# EAGLE design Photobooth-RasPI-Controller (EAGLE 7.1.0)

## Sheet 1 of 3
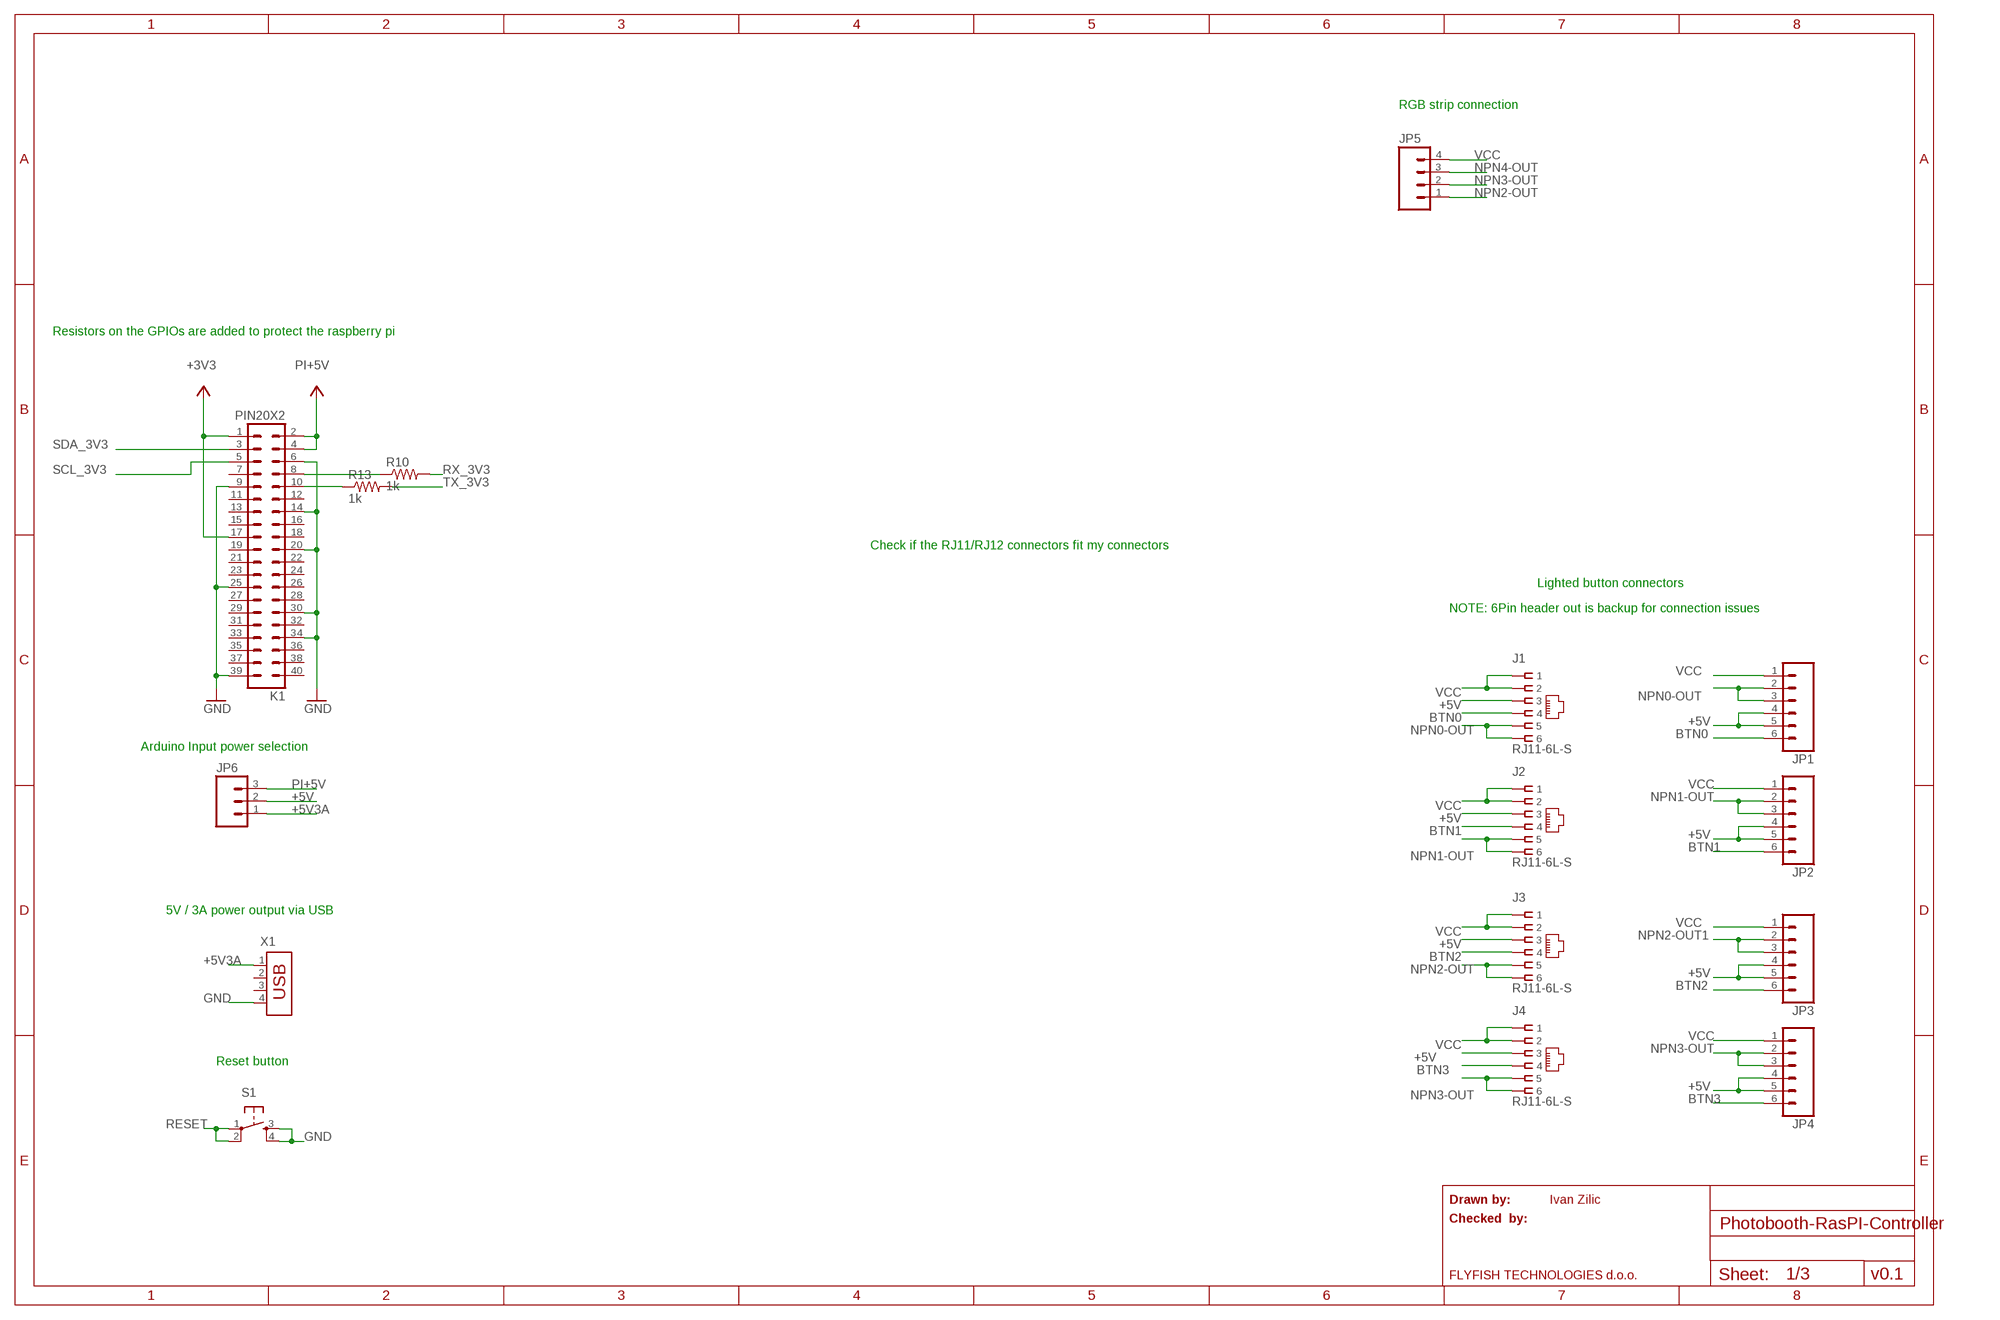
[diagram p0: schematic, sheet 1]

### Parts
J1  RJ11-6L-S  [RJ11-NO_SHIELD]
J2  RJ11-6L-S  [RJ11-NO_SHIELD]
J3  RJ11-6L-S  [RJ11-NO_SHIELD]
J4  RJ11-6L-S  [RJ11-NO_SHIELD]
JP1  M06LOCK  [1X06_LOCK]
JP2  M06LOCK  [1X06_LOCK]
JP3  M06LOCK  [1X06_LOCK]
JP4  M06LOCK  [1X06_LOCK]
JP5  M04LOCK  [1X04_LOCK]
JP6  M03LOCK  [1X03_LOCK]
K1  PIN20X2  [PIN_20X2]
R10  1k  RESISTOR0805-RES  [0805]
R13  1k  RESISTOR0805-RES  [0805]
S1  TAC_SWITCHPTH  [TACTILE-PTH]
X1  USB-787616  [USB]

### Nets
+3V3: K1.1 K1.17 ; also sheet 2
+5V: J1.3 J2.3 J3.3 J4.3 JP1.4 JP1.5 JP2.4 JP2.5 JP3.4 JP3.5 JP4.4 JP4.5 JP6.2 ; also sheet 2
+5V3A: JP6.1 X1.1 ; also sheet 2
BTN0: J1.4 JP1.6 ; also sheet 2
BTN1: J2.4 JP2.6 ; also sheet 2
BTN2: J3.4 JP3.6 ; also sheet 2
BTN3: J4.4 JP4.6 ; also sheet 2
GND: K1.6 K1.9 K1.14 K1.20 K1.25 K1.30 K1.34 K1.39 S1.3 S1.4 X1.4 ; also sheet 2,3
N$3: K1.8 R10.1
N$5: K1.10 R13.1
NPN0-OUT: J1.5 J1.6 JP1.2 JP1.3 ; also sheet 3
NPN1-OUT: J2.5 J2.6 JP2.2 JP2.3 ; also sheet 3
NPN2-OUT: J3.5 J3.6 JP5.1 ; also sheet 3
NPN2-OUT1: JP3.2 JP3.3
NPN3-OUT: J4.5 J4.6 JP4.2 JP4.3 JP5.2 ; also sheet 3
NPN4-OUT: JP5.3 ; also sheet 3
PI+5V: JP6.3 K1.2 K1.4
RESET: S1.1 S1.2 ; also sheet 2
RX_3V3: R10.2 ; also sheet 2
SCL_3V3: K1.5 ; also sheet 2
SDA_3V3: K1.3 ; also sheet 2
TX_3V3: R13.2 ; also sheet 2
VCC: J1.1 J1.2 J2.1 J2.2 J3.1 J3.2 J4.1 J4.2 JP1.1 JP2.1 JP3.1 JP4.1 JP5.4 ; also sheet 2
Unconnected: K1.7 K1.11 K1.12 K1.13 K1.15 K1.16 K1.18 K1.19 K1.21 K1.22 K1.23 K1.24 K1.26 K1.27 K1.28 K1.29 K1.31 K1.32 K1.33 K1.35 K1.36 K1.37 K1.38 K1.40 X1.2 X1.3

### Notes on the sheet
- RGB strip connection
- Resistors on the GPIOs are added to protect the raspberry pi
- Check if the RJ11/RJ12 connectors fit my connectors
- Lighted button connectors
- NOTE: 6Pin header out is backup for connection issues
- Arduino Input power selection
- 5V / 3A power output via USB
- Reset button
- Drawn by: | Ivan Zilic
- Checked  by:
- FLYFISH TECHNOLOGIES d.o.o. | v0.1

## Sheet 2 of 3
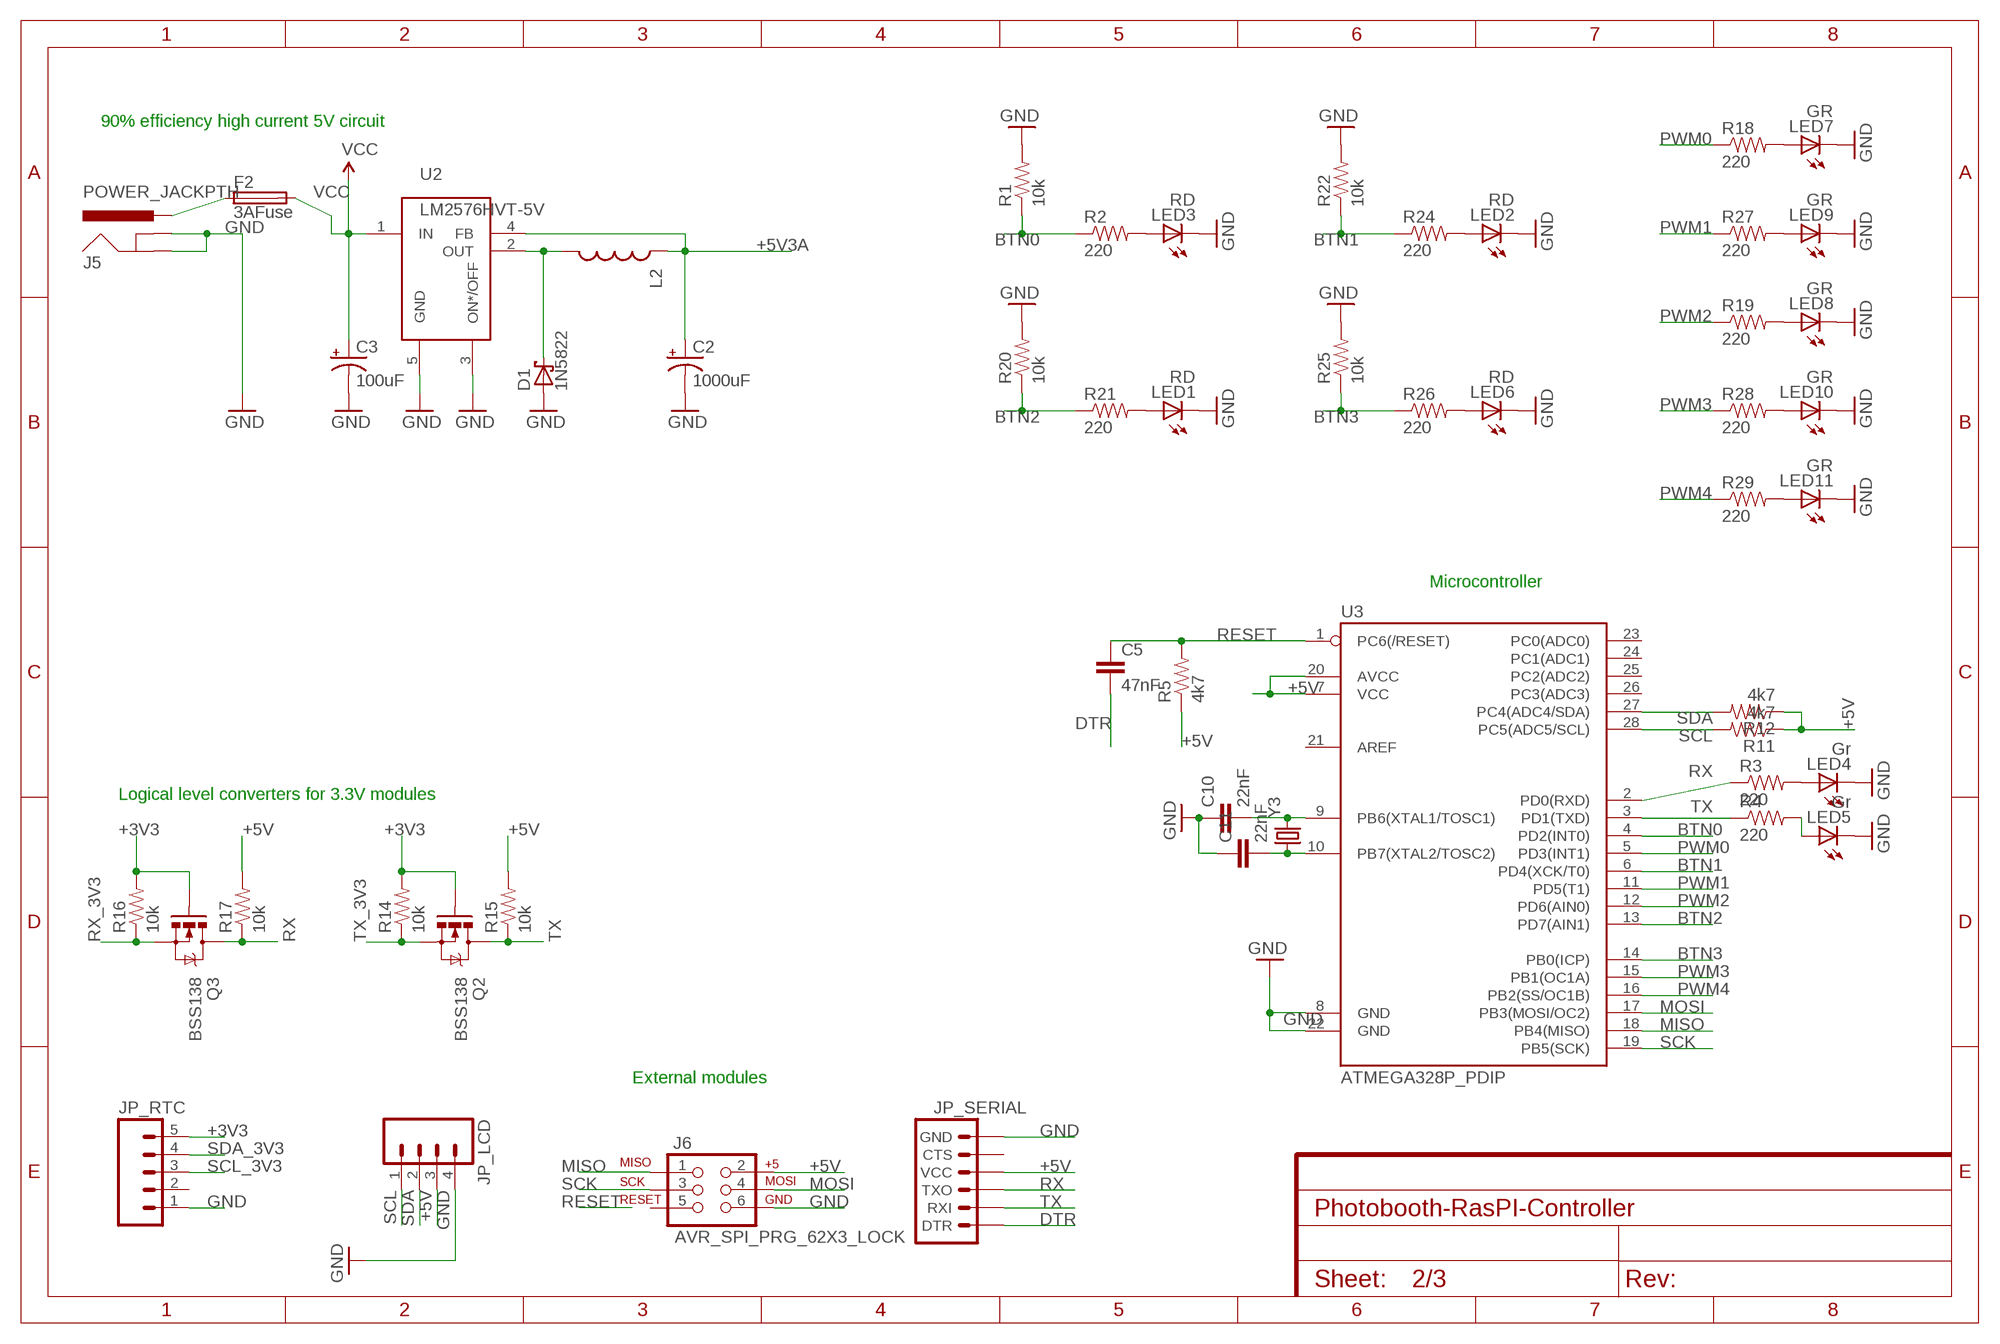
[diagram p1: schematic, sheet 2]

### Parts
C2  1000uF  1000UF-25V(PTH)  [CPOL-RADIAL-1000UF-25V]
C3  100uF  CAP_POLPTH1  [CPOL-RADIAL-100UF-25V]
C5  47nF  CAPPTH  [CAP-PTH-SMALL]
C10  22nF  CAPPTH  [CAP-PTH-SMALL]
C11  22nF  CAPPTH  [CAP-PTH-SMALL]
D1  1N5822  1N5908  [C4111-15]
F2  3AFuse  LITTLEFUSE  [LITTLEFUSE]
J5  POWER_JACKPTH  [POWER_JACK_PTH]
J6  AVR_SPI_PRG_62X3_LOCK  [2X3_LOCK]
JP_LCD  M04PTH  [1X04]
JP_RTC  M05LOCK  [1X05_LOCK]
JP_SERIAL  ARDUINO_SERIAL_PROGRAMLOCK  [1X06_LOCK]
L2  INDUCTORRLB0912  [RLB0912]
LED1  RD  LEDCHIP-LED0805  [CHIP-LED0805]
LED2  RD  LEDCHIP-LED0805  [CHIP-LED0805]
LED3  RD  LEDCHIP-LED0805  [CHIP-LED0805]
LED4  Gr  LEDCHIP-LED0805  [CHIP-LED0805]
LED5  Gr  LEDCHIP-LED0805  [CHIP-LED0805]
LED6  RD  LEDCHIP-LED0805  [CHIP-LED0805]
LED7  GR  LEDCHIP-LED0805  [CHIP-LED0805]
LED8  GR  LEDCHIP-LED0805  [CHIP-LED0805]
LED9  GR  LEDCHIP-LED0805  [CHIP-LED0805]
LED10  GR  LEDCHIP-LED0805  [CHIP-LED0805]
LED11  GR  LEDCHIP-LED0805  [CHIP-LED0805]
Q2  BSS138  MOSFET-NCHANNELBSS138  [SOT23-3]
Q3  BSS138  MOSFET-NCHANNELBSS138  [SOT23-3]
R1  10k  RESISTOR0805-RES  [0805]
R2  220  RESISTOR0805-RES  [0805]
R3  220  RESISTOR0805-RES  [0805]
R4  220  RESISTOR0805-RES  [0805]
R5  4k7  RESISTOR0805-RES  [0805]
R11  4k7  RESISTOR0805-RES  [0805]
R12  4k7  RESISTOR0805-RES  [0805]
R14  10k  RESISTOR0805-RES  [0805]
R15  10k  RESISTOR0805-RES  [0805]
R16  10k  RESISTOR0805-RES  [0805]
R17  10k  RESISTOR0805-RES  [0805]
R18  220  RESISTOR0805-RES  [0805]
R19  220  RESISTOR0805-RES  [0805]
R20  10k  RESISTOR0805-RES  [0805]
R21  220  RESISTOR0805-RES  [0805]
R22  10k  RESISTOR0805-RES  [0805]
R24  220  RESISTOR0805-RES  [0805]
R25  10k  RESISTOR0805-RES  [0805]
R26  220  RESISTOR0805-RES  [0805]
R27  220  RESISTOR0805-RES  [0805]
R28  220  RESISTOR0805-RES  [0805]
R29  220  RESISTOR0805-RES  [0805]
U2  LM2576HVT-5V  LM2576  [LM2576]
U3  ATMEGA328P_PDIP  [DIL28-3]
Y3  CRYSTALHC49UV  [HC49U-V]

### Nets
+3V3: JP_RTC.5 Q2.1(G) Q3.1(G) R14.2 R16.2 ; also sheet 1
+5V: J6.2 JP_LCD.3 JP_SERIAL.4(VCC) R5.1 R11.1 R12.1 R15.2 R17.2 U3.7(VCC) U3.20(AVCC) ; also sheet 1
+5V3A: C2.+ L2.1 U2.4(FB) ; also sheet 1
BTN0: R1.1 R2.1 U3.4(PD2(INT0)) ; also sheet 1
BTN1: R22.1 R24.1 U3.6(PD4(XCK/T0)) ; also sheet 1
BTN2: R20.1 R21.1 U3.13(PD7(AIN1)) ; also sheet 1
BTN3: R25.1 R26.1 U3.14(PB0(ICP)) ; also sheet 1
DTR: C5.2 JP_SERIAL.1(DTR)
GND: C2.- C3.2(-) C10.1 C11.1 D1.A J5.GND J5.GNDBREAK J6.6 JP_LCD.4 JP_RTC.1 JP_SERIAL.6(GND) LED1.C LED2.C LED3.C LED4.C LED5.C LED6.C LED7.C LED8.C LED9.C LED10.C LED11.C R1.2 R20.2 R22.2 R25.2 U2.3(ON*/OFF) U2.5(GND) U3.8(GND) U3.22(GND) ; also sheet 1,3
MISO: J6.1 U3.18(PB4(MISO))
MOSI: J6.4 U3.17(PB3(MOSI/OC2))
N$1: C11.2 U3.10(PB7(XTAL2/TOSC2)) Y3.1
N$2: C10.2 U3.9(PB6(XTAL1/TOSC1)) Y3.2
N$4: D1.C L2.2 U2.2(OUT)
N$6: LED7.A R18.2
N$7: LED8.A R19.2
N$8: LED1.A R21.2
N$9: LED2.A R24.2
N$10: LED6.A R26.2
N$11: LED9.A R27.2
N$12: LED10.A R28.2
N$13: LED11.A R29.2
N$15: F2.1 J5.PWR
N$23: LED3.A R2.2
N$24: LED4.A R3.2
N$25: LED5.A R4.2
PWM0: R18.1 U3.5(PD3(INT1)) ; also sheet 3
PWM1: R27.1 U3.11(PD5(T1)) ; also sheet 3
PWM2: R19.1 U3.12(PD6(AIN0)) ; also sheet 3
PWM3: R28.1 U3.15(PB1(OC1A)) ; also sheet 3
PWM4: R29.1 U3.16(PB2(SS/OC1B)) ; also sheet 3
RESET: C5.1 R5.2 U3.1(PC6(/RESET)) ; also sheet 1
RX: JP_SERIAL.3(TXO) Q3.3(D) R3.1 R17.1 U3.2(PD0(RXD))
RX_3V3: Q3.2(S) R16.1 ; also sheet 1
SCK: J6.3 U3.19(PB5(SCK))
SCL: JP_LCD.1 R11.2 U3.28(PC5(ADC5/SCL))
SCL_3V3: JP_RTC.3 ; also sheet 1
SDA: JP_LCD.2 R12.2 U3.27(PC4(ADC4/SDA))
SDA_3V3: JP_RTC.4 ; also sheet 1
TX: JP_SERIAL.2(RXI) Q2.3(D) R4.1 R15.1 U3.3(PD1(TXD))
TX_3V3: Q2.2(S) R14.1 ; also sheet 1
VCC: C3.1(+) F2.2 U2.1(IN) ; also sheet 1
Unconnected: J6.5 JP_RTC.2 JP_SERIAL.5(CTS) U3.21(AREF) U3.23(PC0(ADC0)) U3.24(PC1(ADC1)) U3.25(PC2(ADC2)) U3.26(PC3(ADC3))

### Notes on the sheet
- 90% efficiency high current 5V circuit
- Microcontroller
- Logical level converters for 3.3V modules
- External modules

## Sheet 3 of 3
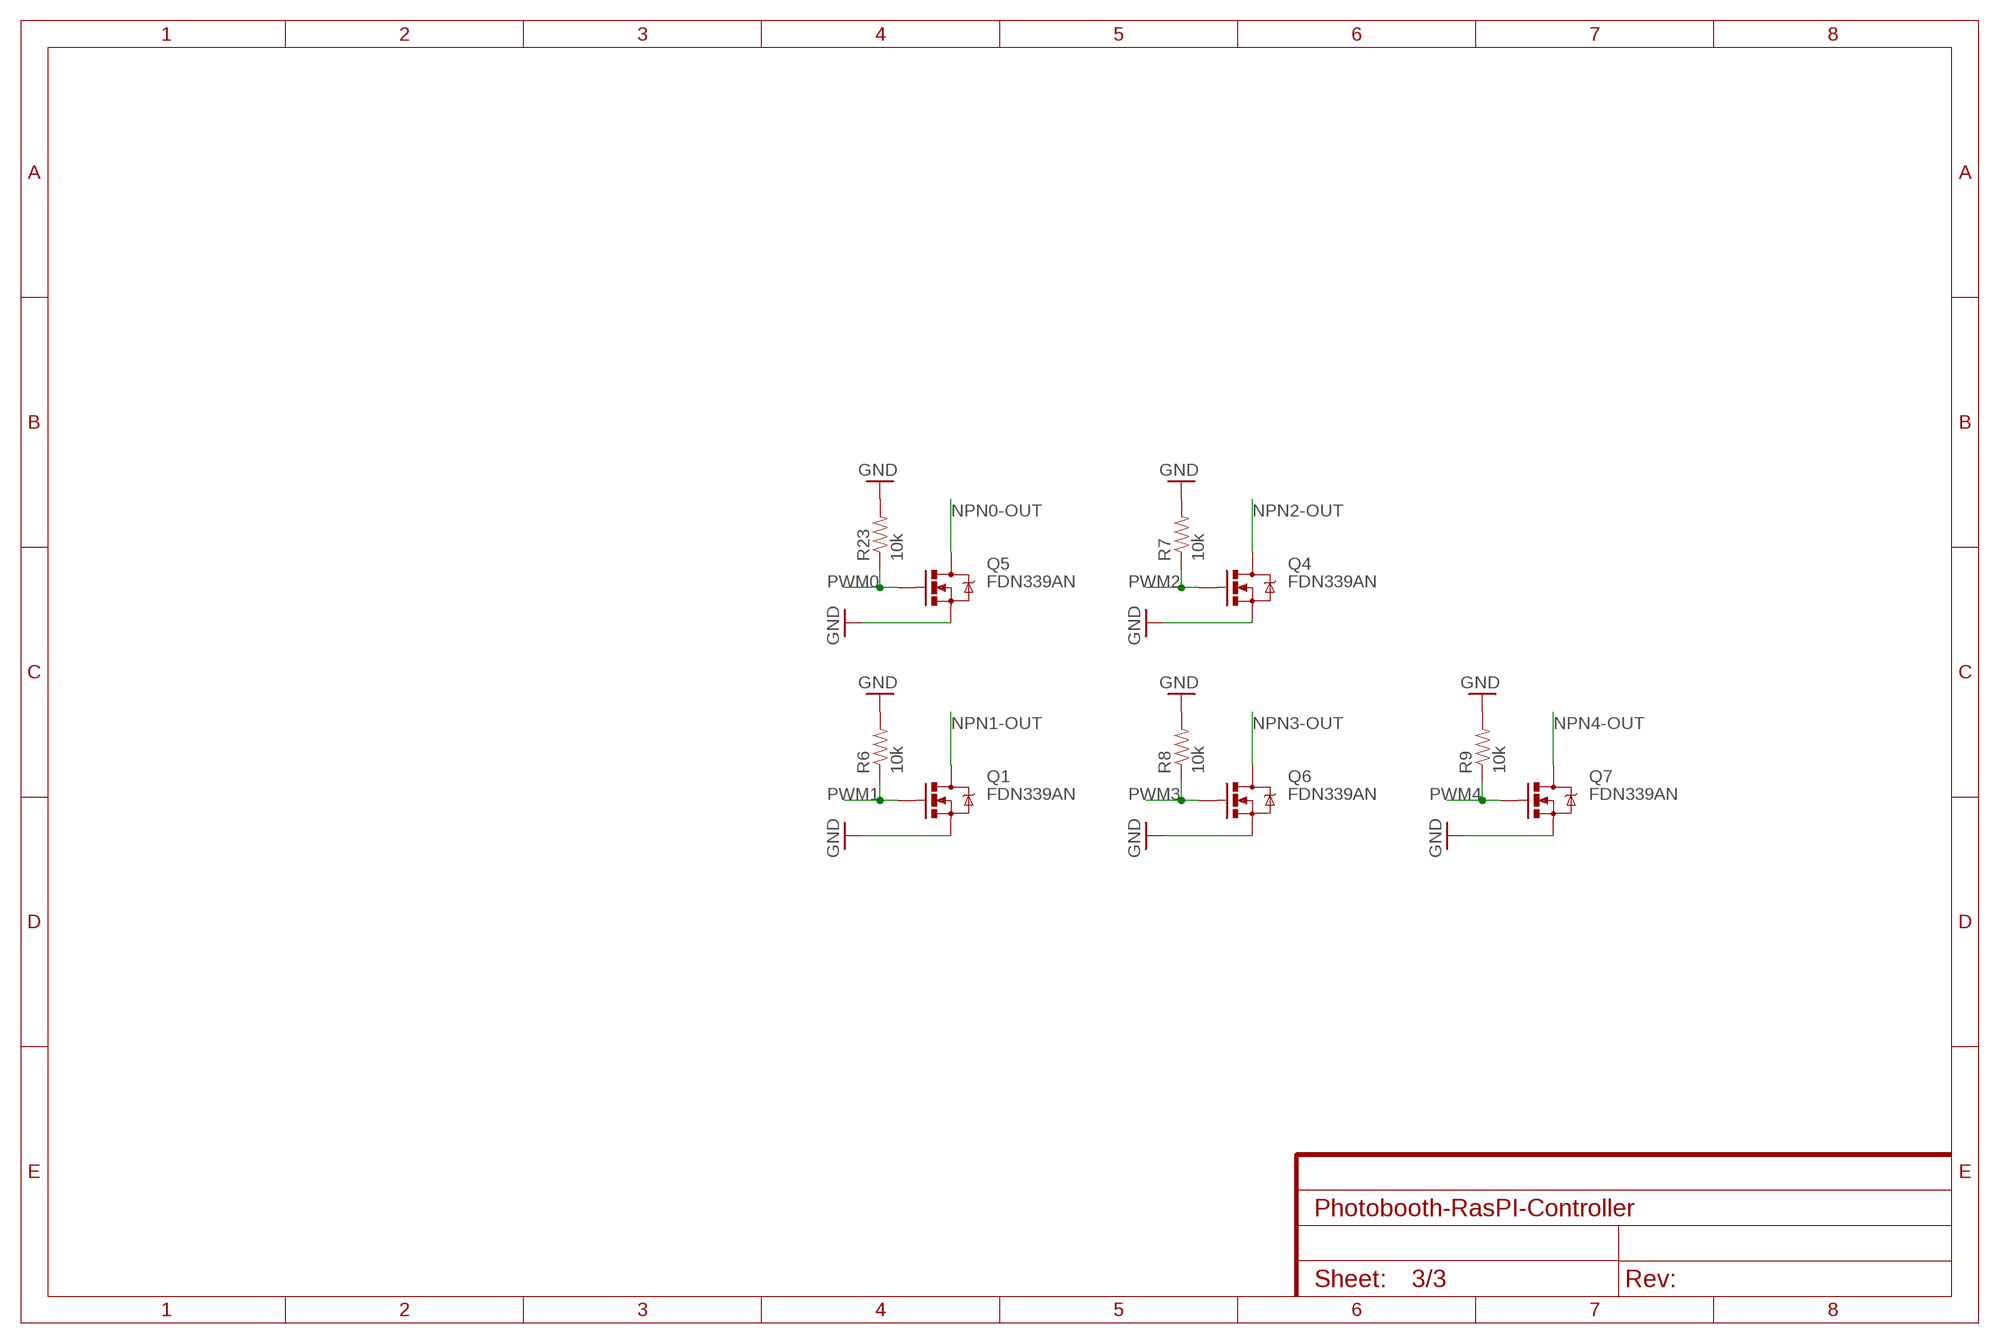
[diagram p2: schematic, sheet 3]

### Parts
Q1  FDN339AN  MOSFET-NCHANNELBSS138  [SOT23-3]
Q4  FDN339AN  MOSFET-NCHANNELBSS138  [SOT23-3]
Q5  FDN339AN  MOSFET-NCHANNELBSS138  [SOT23-3]
Q6  FDN339AN  MOSFET-NCHANNELBSS138  [SOT23-3]
Q7  FDN339AN  MOSFET-NCHANNELBSS138  [SOT23-3]
R6  10k  RESISTOR0805-RES  [0805]
R7  10k  RESISTOR0805-RES  [0805]
R8  10k  RESISTOR0805-RES  [0805]
R9  10k  RESISTOR0805-RES  [0805]
R23  10k  RESISTOR0805-RES  [0805]

### Nets
GND: Q1.2(S) Q4.2(S) Q5.2(S) Q6.2(S) Q7.2(S) R6.2 R7.2 R8.2 R9.2 R23.2 ; also sheet 1,2
NPN0-OUT: Q5.3(D) ; also sheet 1
NPN1-OUT: Q1.3(D) ; also sheet 1
NPN2-OUT: Q4.3(D) ; also sheet 1
NPN3-OUT: Q6.3(D) ; also sheet 1
NPN4-OUT: Q7.3(D) ; also sheet 1
PWM0: Q5.1(G) R23.1 ; also sheet 2
PWM1: Q1.1(G) R6.1 ; also sheet 2
PWM2: Q4.1(G) R7.1 ; also sheet 2
PWM3: Q6.1(G) R8.1 ; also sheet 2
PWM4: Q7.1(G) R9.1 ; also sheet 2

## Library data of the parts
C2 = SparkFun-Capacitors:1000UF-25V(PTH): CAP-08070; PROD_ID: CAP-09538; VALUE: CAP-09538
C3 = SparkFun-Capacitors:CAP_POL: Capacitor Polarized These are standard SMD and PTH capacitors. Normally 10uF, 47uF, and 100uF in electrolytic and tantalum varieties. Always verify the external diameter of the through hole cap, it varies with capacity, voltage, and manufacturer. The EIA devices should be standard.
C5 C10 C11 = SparkFun-Capacitors:CAP: Capacitor Standard 0603 ceramic capacitor, and 0.1" leaded capacitor.
D1 = diode:1N5908: DIODE schottky
F2 = fuse:LITTLEFUSE: LITTLEFUSE Picofuse/slow Littlefuse; OC_FARNELL: unknown; OC_NEWARK: unknown
J1-J4 = con-tycoelectronics:RJ11: CORCOM Modular RJ Jacks No Shield Source: www.tycoelectronics.com .. ENG_DS_1654001_1099_RJ_L_0507.pdf; MF: TYCO ELECTRONICS; MPN: RJ11-6L-S; OC_FARNELL: 1654827; OC_NEWARK: 50F1358
J5 = SparkFun-Connectors:POWER_JACK: Power Jack This is the standard 5.5mm barrel jack for power. The PTH is the most common, proven, reliable, footprint. The Slot footprint only works if the mill layer is transmitted to the PCB fab house so be warned. Mating wall wart : TOL-00298 (and others); PROD_ID: PRT-00119
J6 = SparkFun-Connectors:AVR_SPI_PRG_6: AVR ISP 6 Pin This is the reduced ISP connector for AVR programming. Common on Arduino. This footprint will take up less PCB space and can be used with a 10-pin to 6-pin adapter such as SKU: BOB-08508 **Special note about "TEST_POINT" package. The stop mask is on the top side, so if you want your programming test points to be on the bottom of your board, make sure to place this package on the bottom side of the board. This also ensure that the orientation to program from the bottom side will be correct.
JP1-JP4 = SparkFun-Connectors:M06: Header 6 Standard 6-pin 0.1" header. Use with straight break away headers (SKU : PRT-00116), right angle break away headers (PRT-00553), swiss pins (PRT-00743), machine pins (PRT-00117), and female headers (PRT-00115). Molex polarized connector foot print use with SKU : PRT-08094 with associated crimp pins and housings. NOTES ON THE VARIANTS LOCK and LOCK_LONGPADS... This footprint was designed to help hold the alignment of a through-hole component (i.e. 6-pin header) while soldering it into place. You may notice that each hole has been shifted either up or down by 0.005 of an inch from it's more standard position (which is a perfectly straight line). This slight alteration caused the pins (the squares in the middle) to touch the edges of the holes. Because they are alternating, it causes a "brace" to hold the component in place. 0.005 has proven to be the perfect amount of "off-center" position when using our standard breakaway headers. Although looks a little odd when you look at the bare footprint, once you have a header in there, the alteration is very hard to notice. Also,if you push a header all the way into place, it is covered up entirely on the bottom side. This idea of altering the position of holes to aid alignment will be further integrated into the Sparkfun Library for other footprints. It can help hold any component with 3 or more connection pins.
JP5 JP_LCD = SparkFun-Connectors:M04: Header 4 Standard 4-pin 0.1" header. Use with straight break away headers (SKU : PRT-00116), right angle break away headers (PRT-00553), swiss pins (PRT-00743), machine pins (PRT-00117), and female headers (PRT-00115). Molex polarized connector foot print use with SKU : PRT-08231 with associated crimp pins and housings. 1MM SMD Version SKU: PRT-10208
JP6 = SparkFun-Connectors:M03: Header 3 Standard 3-pin 0.1" header. Use with straight break away headers (SKU : PRT-00116), right angle break away headers (PRT-00553), swiss pins (PRT-00743), machine pins (PRT-00117), and female headers (PRT-00115). Molex polarized connector foot print use with SKU : PRT-08232 with associated crimp pins and housings.
JP_RTC = SparkFun-Connectors:M05: Header 5 Standard 5-pin 0.1" header. Use with straight break away headers (SKU : PRT-00116), right angle break away headers (PRT-00553), swiss pins (PRT-00743), machine pins (PRT-00117), and female headers (PRT-00115). Molex polarized connector foot print use with SKU : PRT-08230 with associated crimp pins and housings.
JP_SERIAL = SparkFun-Connectors:ARDUINO_SERIAL_PROGRAM: FTDI connector footprints
K1 = FLYFISH:PIN20X2
L2 = SparkFun-Passives:INDUCTOR: Inductors Basic Inductor/Choke - 0603 and 1206. Footprints are not proven and vary greatly between part numbers. SRN6045- 33uH, 20% 1.4A SDR0403-560KL - 56uH, 10%, 500mA RMS/740mA peak
LED1-LED11 = led:LED: LED OSRAM: - CHIPLED LG R971, LG N971, LY N971, LG Q971, LY Q971, LO R971, LY R971 LH N974, LH R974 LS Q976, LO Q976, LY Q976 LO Q996 - Hyper CHIPLED LW Q18S LB Q993, LB Q99A, LB R99A - SideLED LS A670, LO A670, LY A670, LG A670, LP A670 LB A673, LV A673, LT A673, LW A673 LH A674 LY A675 LS A676, LA A676, LO A676, LY A676, LW A676 LS A679, LY A679, LG A679 - Hyper Micro SIDELED® LS Y876, LA Y876, LO Y876, LY Y876 LT Y87S - SmartLED LW L88C, LW L88S LB L89C, LB L89S, LG L890 LS L89K, LO L89K, LY L89K LS L896, LA L896, LO L896, LY L896 - TOPLED LS T670, LO T670, LY T670, LG T670, LP T670 LSG T670, LSP T670, LSY T670, LOP T670, LYG T670 LG T671, LOG T671, LSG T671 LB T673, LV T673, LT T673, LW T673 LH T674 LS T676, LA T676, LO T676, LY T676, LB T676, LH T676, LSB T676, LW T676 LB T67C, LV T67C, LT T67C, LS T67K, LO T67K, LY T67K, LW E67C LS E67B, LA E67B, LO E67B, LY E67B, LB E67C, LV E67C, LT E67C LW T67C LS T679, LY T679, LG T679 LS T770, LO T770, LY T770, LG T770, LP T770 LB T773, LV T773, LT T773, LW T773 LH T774 LS E675, LA E675, LY E675, LS T675 LS T776, LA T776, LO T776, LY T776, LB T776 LHGB T686 LT T68C, LB T68C - Hyper Mini TOPLED® LB M676 - Mini TOPLED Santana® LG M470 LS M47K, LO M47K, LY M47K Source: http://www.osram.convergy.de LUXEON: - LUMILED® LXK2-PW12-R00, LXK2-PW12-S00, LXK2-PW14-U00, LXK2-PW14-V00 LXK2-PM12-R00, LXK2-PM12-S00, LXK2-PM14-U00 LXK2-PE12-Q00, LXK2-PE12-R00, LXK2-PE12-S00, LXK2-PE14-T00, LXK2-PE14-U00 LXK2-PB12-K00, LXK2-PB12-L00, LXK2-PB12-M00, LXK2-PB14-N00, LXK2-PB14-P00, LXK2-PB14-Q00 LXK2-PR12-L00, LXK2-PR12-M00, LXK2-PR14-Q00, LXK2-PR14-R00 LXK2-PD12-Q00, LXK2-PD12-R00, LXK2-PD12-S00 LXK2-PH12-R00, LXK2-PH12-S00 LXK2-PL12-P00, LXK2-PL12-Q00, LXK2-PL12-R00 Source: www.luxeon.com KINGBRIGHT: KA-3528ASYC Source: www.kingbright.com
Q1-Q7 = SparkFun-DiscreteSemi:MOSFET-NCHANNEL: Common NMOSFET Parts MFG P/N Store ID Prod ID FDD8780 TRANS-09984 SI7820DN TRANS-11055 FDS6630A IC-08089 2N7002PW TRANS-11151 FQP30N06L COM-10213 TRANS-10060 BSS123LT1G TRANS-08345 BSS138 TRANS-00830 BS170 2N7000; PROD_ID: TRANS-00830
R1-R29 = SparkFun-Passives:RESISTOR: Resistor Basic schematic elements and footprints for 0603, 1206, and PTH resistors.
S1 = SparkFun-Electromechanical:TAC_SWITCH: Momentary Switch Button commonly used for reset or general input. Spark Fun Electronics SKU : COM-00097 SMT- SWCH-08247
U2 = LM2576:LM2576: LM2576 - 5V switching regulator
U3 = SparkFun-DigitalIC:ATMEGA328P_PDIP: uC used in the Arduino 32kb flash, 1k EEPROM, 2k SRAM This is the through-hole version of this chip.
X1 = con-amp:USB-787616: AMP connector
Y3 = SparkFun-FreqCtrl:CRYSTAL: Various standard crystals. Proven footprints. Spark Fun Electronics SKU : COM-00534

## Board
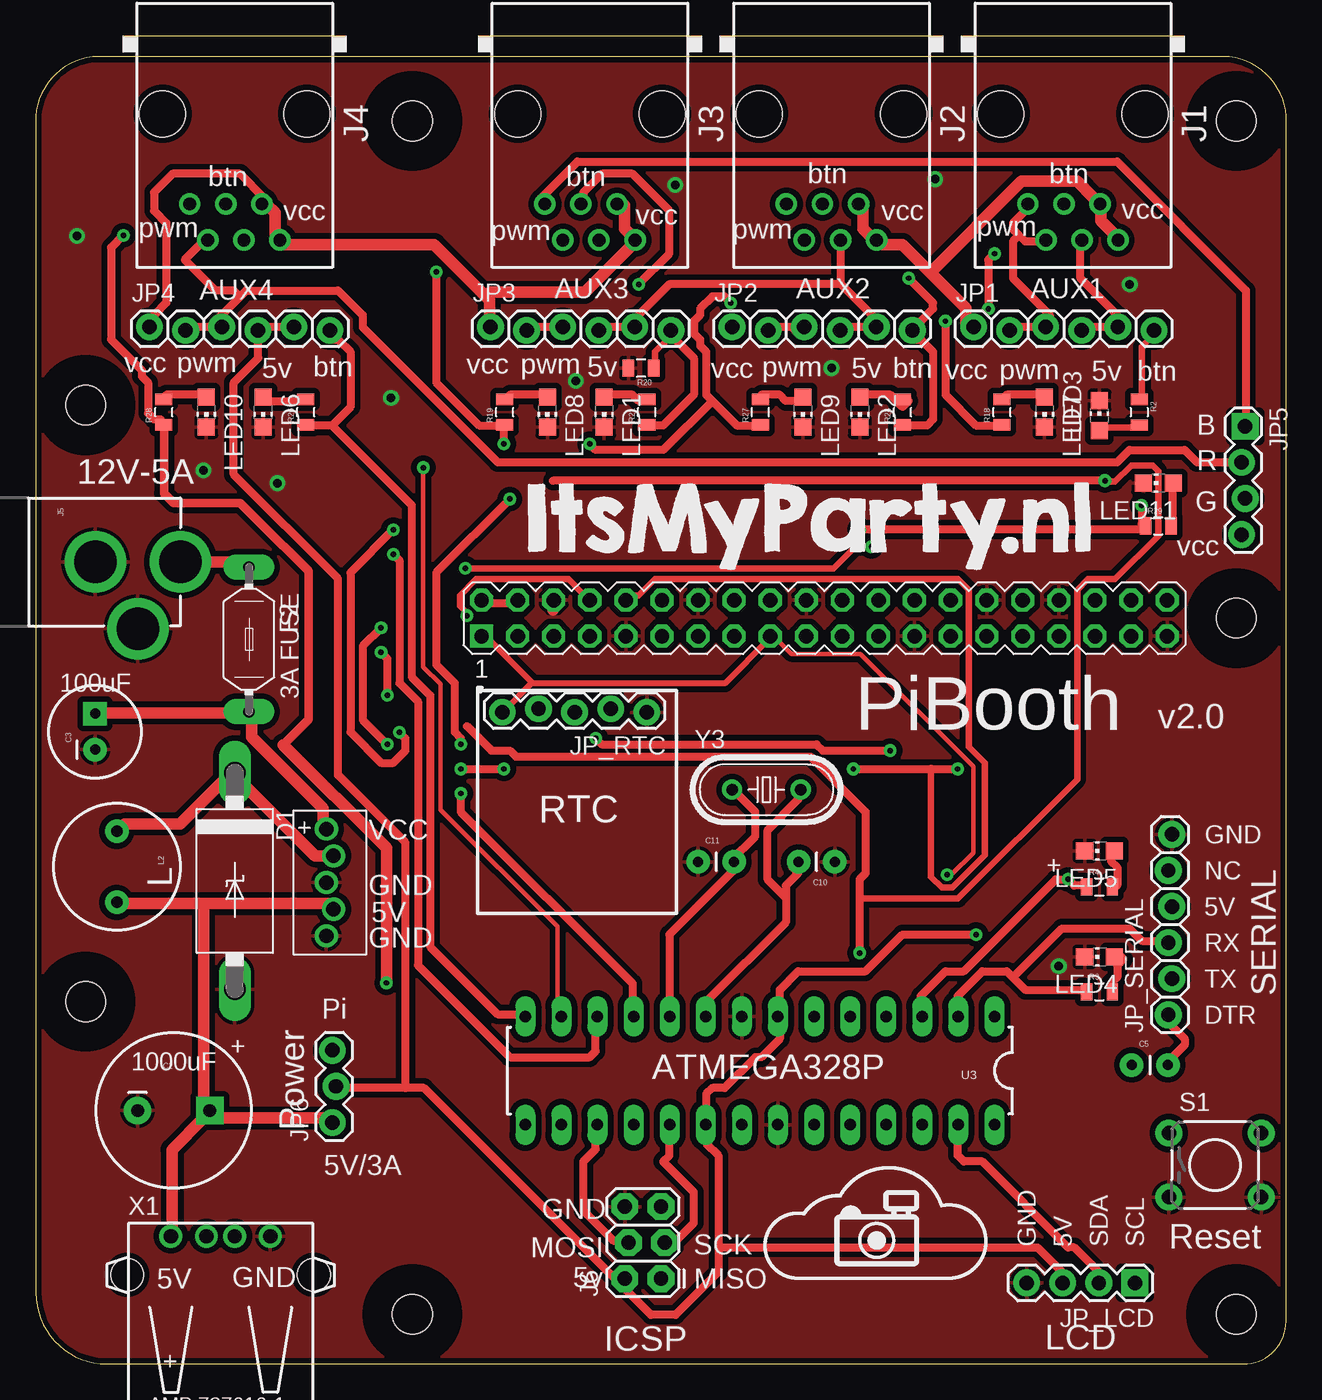
[diagram p3: board, top side]
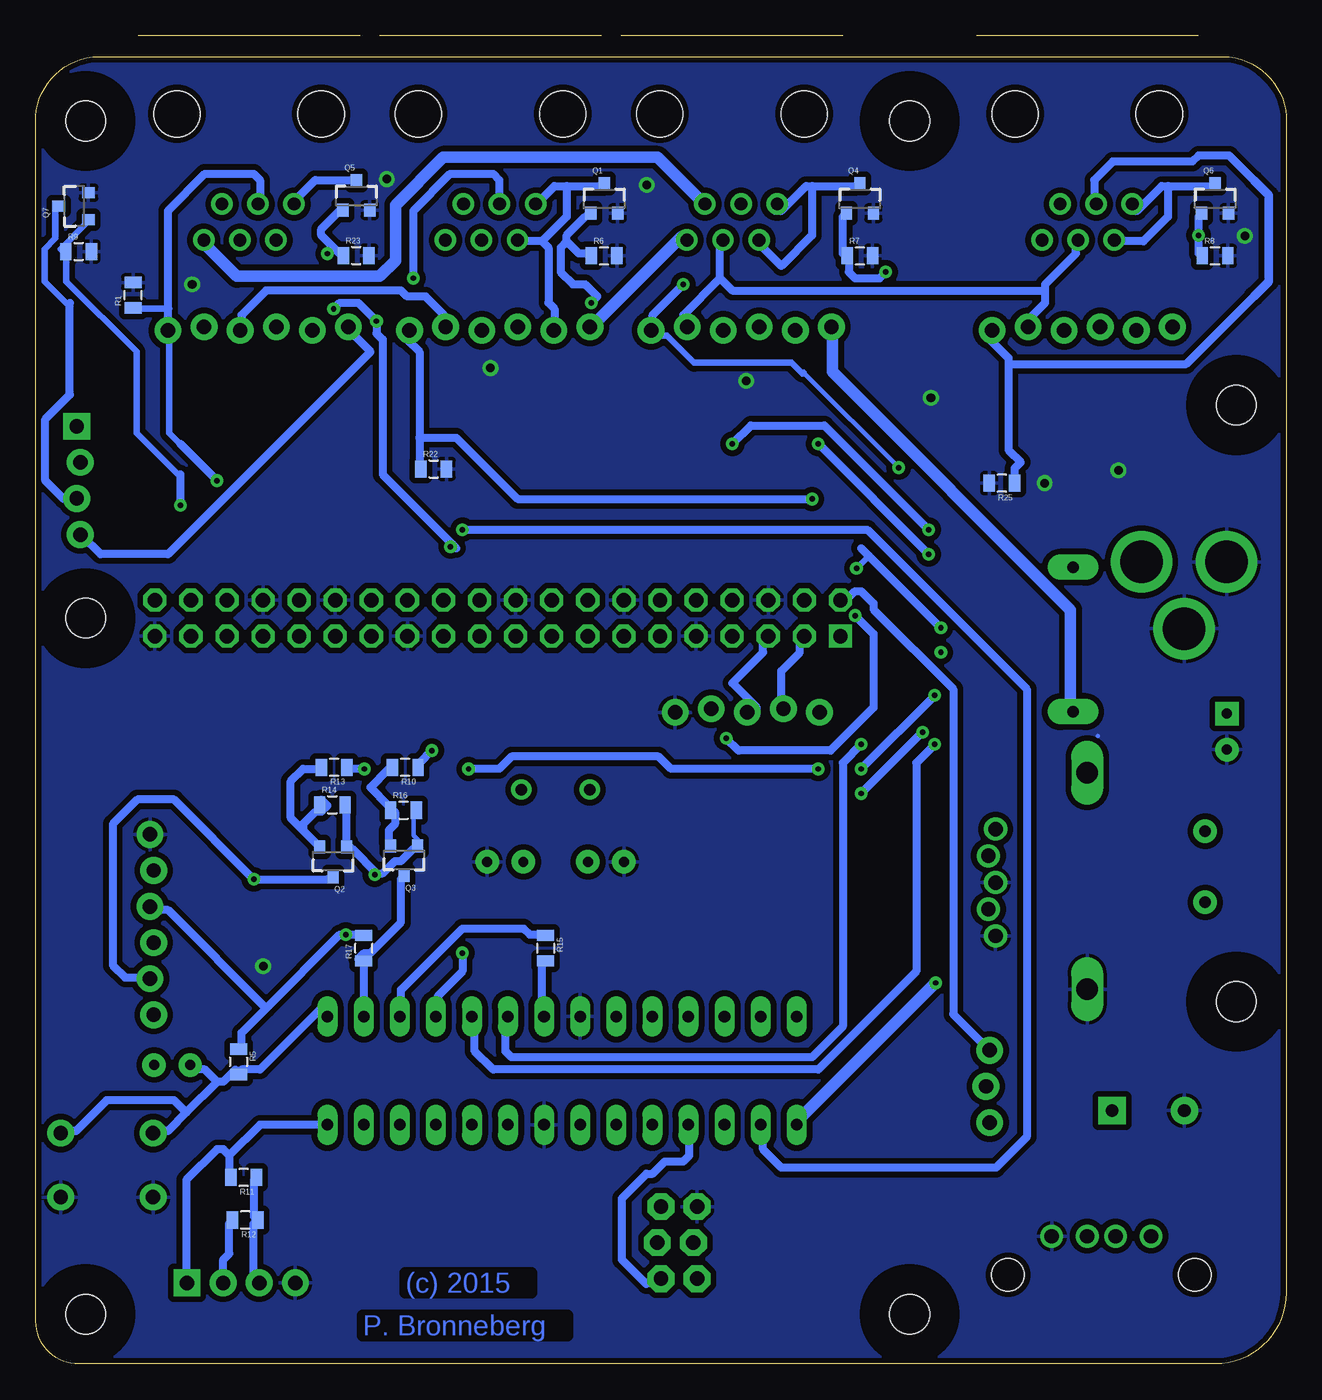
[diagram p4: board, bottom side, seen from below]

Size 88.05 x 92 mm. Coordinates in mm from the lower left corner, seen from the top.
Outline: 0.03,5 arc90 5.03,0 85.03,0 arc90 88.03,3 88.03,87 arc90 84.03,92 4.03,92 arc90 0.03,87 0.03,5
Copper layers (1*16): Top 0.035mm / dielectric 1.5mm / Bottom 0.035mm
Design rules "SparkFun-2-layer *": minimum track width 18mil, minimum drill 15mil, track to track 12mil, track to pad 8mil, pad to pad 8mil, via to via 8mil, smd to smd 8mil, copper to edge 12mil, drill to drill 12mil, minimum pad ring 12mil, minimum via ring 10mil, stop-mask expansion 4mil, vias tented up to drill 20mil, thermal gap 10mil
Holes 2.8 mm at 26.53,3.5 84.53,52.5 84.53,3.5 26.53,87.5 84.53,87.5 3.53,67.5 3.53,25.5
tRestrict: area 83,50.9 to 86.1,54; area 83,1.9 to 86.1,5; area 25,1.9 to 28.1,5; area 25,85.9 to 28.1,89; area 83,85.9 to 86.1,89; area 2,65.9 to 5.1,69; area 2,23.9 to 5.1,27
bRestrict: area 25,1.9 to 28.1,5; area 83,1.9 to 86.1,5; area 83,50.9 to 86.1,54; area 25,85.9 to 28.1,89; area 83,85.9 to 86.1,89; area 2,65.9 to 5.1,69; area 2,23.9 to 5.1,27

### Footprints (pad centres in the part's own frame; a part is rotated, then mirrored left to right if it is on the bottom)
CPOL-RADIAL-1000UF-25V = drill 0.9 pad 1.93 square: + 2.54,0 | drill 0.9 pad 1.93: - -2.54,0
CPOL-RADIAL-100UF-25V = drill 0.7 pad 1.651 square: 1 1.27,0 | drill 0.7 pad 1.651: 2 -1.27,0
CAP-PTH-SMALL = drill 0.7 pad 1.651: 1 0,0; 2 2.54,0
C4111-15 = drill 1.499 long: A 7.62,0; C -7.62,0
LITTLEFUSE = drill 0.813 pad 1.778 long: 1 -5.08,0; 2 5.08,0
RJ11-NO_SHIELD = drill 0.9 pad 1.4: 1 -3.175,8.89; 2 -1.905,6.35; 3 -0.635,8.89; 4 0.635,6.35; 5 1.905,8.89; 6 3.175,6.35 | hole 3.251: -5.08,0; 5.08,0
POWER_JACK_PTH = drill 2.997 pad 4.318: GND 0,7.7; GNDBREAK 4.7,10.7; PWR 0,13.7
2X3_LOCK = drill 1.016 pad 1.88 octagon: 1 0,0; 2 0,2.54; 3 2.54,-0.254; 4 2.54,2.286; 5 5.08,0; 6 5.08,2.54
1X06_LOCK = drill 1.016 pad 1.88: 1 0,0; 2 2.54,-0.254; 3 5.08,0; 4 7.62,-0.254; 5 10.16,0; 6 12.7,-0.254
1X04_LOCK = drill 1.016 pad 1.88 square: 1 0,0.127 | drill 1.016 pad 1.88: 2 2.54,-0.127; 3 5.08,0.127; 4 7.62,-0.127
1X03_LOCK = drill 1.016 pad 1.88: 1 0,0.127; 2 2.54,-0.127; 3 5.08,0.127
1X04 = drill 1.016 pad 1.88 square: 1 0,0 | drill 1.016 pad 1.88: 2 2.54,0; 3 5.08,0; 4 7.62,0
1X05_LOCK = drill 1.016 pad 1.88: 1 0,0.127; 2 2.54,-0.127; 3 5.08,0.127; 4 7.62,-0.127; 5 10.16,0.127
PIN_20X2 = drill 1.016 square: 1 -24.13,-1.27 | drill 1.016 octagon: 2 -24.13,1.27; 3 -21.59,-1.27; 4 -21.59,1.27; 5 -19.05,-1.27; 6 -19.05,1.27; 7 -16.51,-1.27; 8 -16.51,1.27; 9 -13.97,-1.27; 10 -13.97,1.27; 11 -11.43,-1.27; 12 -11.43,1.27; 13 -8.89,-1.27; 14 -8.89,1.27; 15 -6.35,-1.27; 16 -6.35,1.27; 17 -3.81,-1.27; 18 -3.81,1.27; 19 -1.27,-1.27; 20 -1.27,1.27; 21 1.27,-1.27; 22 1.27,1.27; 23 3.81,-1.27; 24 3.81,1.27; 25 6.35,-1.27; 26 6.35,1.27; 27 8.89,-1.27; 28 8.89,1.27; 29 11.43,-1.27; 30 11.43,1.27; 31 13.97,-1.27; 32 13.97,1.27; 33 16.51,-1.27; 34 16.51,1.27; 35 19.05,-1.27; 36 19.05,1.27; 37 21.59,-1.27; 38 21.59,1.27; 39 24.13,-1.27; 40 24.13,1.27
RLB0912 = drill 0.813 pad 1.651: 1 2.502,0; 2 -2.502,0
CHIP-LED0805 = smd 1.2 x 1.2: A 0,-1.05; C 0,1.05
SOT23-3 = smd 0.8 x 0.9: 1 -0.95,-1; 2 0.95,-1; 3 0,1.1
0805 = smd 0.8 x 1.2: 1 -0.9,0; 2 0.9,0
TACTILE-PTH = drill 1.016 pad 1.88: 1 -3.251,2.261; 2 3.251,2.261; 3 -3.251,-2.261; 4 3.251,-2.261
LM2576 = drill 1.016: 1 -3.759,-0.254; 2 -1.88,0.254; 3 0,-0.254; 4 1.88,0.254; 5 3.759,-0.254
DIL28-3 = drill 0.813 long: 1 -16.51,-3.81; 2 -13.97,-3.81; 3 -11.43,-3.81; 4 -8.89,-3.81; 5 -6.35,-3.81; 6 -3.81,-3.81; 7 -1.27,-3.81; 8 1.27,-3.81; 9 3.81,-3.81; 10 6.35,-3.81; 11 8.89,-3.81; 12 11.43,-3.81; 13 13.97,-3.81; 14 16.51,-3.81; 15 16.51,3.81; 16 13.97,3.81; 17 11.43,3.81; 18 8.89,3.81; 19 6.35,3.81; 20 3.81,3.81; 21 1.27,3.81; 22 -1.27,3.81; 23 -3.81,3.81; 24 -6.35,3.81; 25 -8.89,3.81; 26 -11.43,3.81; 27 -13.97,3.81; 28 -16.51,3.81
USB = drill 1: 1 -3.5,12.99; 2 -1,12.99; 3 1,12.99; 4 3.5,12.99 | hole 2.3: -6.57,10.28; 6.57,10.28
HC49U-V = drill 0.813: 1 -2.413,0; 2 2.413,0

### Placement (x,y rotation side)
C2  9.73,17.84 0 top
C3  4.19,44.51 90 top
C5  77.17,21.04 0 top
C10  56.26,35.35 180 top
C11  46.64,35.35 0 top
D1  14.03,34 270 top
F2  15.03,51 270 top
J1  73.03,88 180 top
J2  56.03,88 180 top
J3  39.03,88 180 top
J4  14.03,88 180 top
J5  -3.49,56.46 270 top
J6  44.03,6 90 top
JP1  66.03,73 0 top
JP2  49.03,73 0 top
JP3  32.03,73 0 top
JP4  8.03,73 0 top
JP5  85.03,66 270 top
JP6  21.03,17 90 top
JP_LCD  77.39,5.71 180 top
JP_RTC  43.03,46 180 top
JP_SERIAL  79.74,24.58 90 top
K1  55.53,52.5 0 top
L2  5.73,35 270 top
LED1  40.03,67 180 top
LED2  58.03,67 180 top
LED3  74.89,66.75 0 top
LED4  74.9,28.66 90 top
LED5  74.9,36.12 90 top
LED6  16.03,67 180 top
LED7  71.03,67 180 top
LED8  36.03,67 180 top
LED9  54.03,67 180 top
LED10  12.03,67 180 top
LED11  79.03,62 90 top
Q1  48.03,82 0 bottom
Q2  67.11,35.39 180 bottom
Q3  62.11,35.47 180 bottom
Q4  30.03,82 0 bottom
Q5  65.48,82.21 0 bottom
Q6  5.03,82 0 bottom
Q7  85.33,81.5 90 bottom
R1  81.19,75.23 90 bottom
R2  77.69,66.99 270 top
R3  74.9,26.2 0 top
R4  74.9,33.58 0 top
R5  73.77,21.27 270 bottom
R6  48.03,78 0 bottom
R7  30.03,78 0 bottom
R8  5.03,78 0 bottom
R9  85.03,78.3 0 bottom
R10  62.03,42 180 bottom
R11  73.4,13.13 180 bottom
R12  73.29,10.13 180 bottom
R13  67.03,42 180 bottom
R14  67.16,39.36 0 bottom
R15  52.15,29.27 270 bottom
R16  62.16,38.98 0 bottom
R17  64.96,29.27 90 bottom
R18  68.03,67 90 top
R19  33.03,67 90 top
R20  42.63,70.1 180 top
R21  43.03,67 90 top
R22  60.03,63 0 bottom
R23  65.48,78.02 0 bottom
R24  61.03,67 90 top
R25  20.03,62 180 bottom
R26  19.03,67 90 top
R27  51.03,67 90 top
R28  9.03,67 90 top
R29  79.03,59 0 top
S1  83.03,14 0 top
U2  20.73,33.89 270 top
U3  50.99,20.65 180 top
X1  13.03,-4 0 top
Y3  51.45,40.43 0 top

### Tracks (layer width: path | path; a pad name or v marks a point on that pad's centre or on a via)
+3V3  (via drill 0.38)
  Top 0.305: 32.78,46.02 JP_RTC.5 | v64.17,34.44 64.48,34.44 66,35.97 66,42.06 58.08,49.99 53.2,49.99 51.98,51.21 K1.17 51.68,51.21
  Top 0.406: 51.68,51.21 51.68,51.05 48.53,47.9 35.03,47.9 | 35.03,47.9 34.89,47.9 JP_RTC.5 | K1.1 31.7,51.23 35.03,47.9
  Bottom 0.305: R16.2 61.43,38.71 61.43,37.18 61.13,36.88 61.13,36.58 Q3.1 | v64.17,34.44 64.05,34.54
  Bottom 0.559: R14.2 66.21,39.29 66.21,36.7 Q2.1 65.77,36.27 64.05,34.54 63.62,34.54 62.75,35.41 62.32,35.41 61.46,36.27 Q3.1
+5V  (via drill 0.38)
  Top 0.559: JP4.5 17.84,72.97 15.69,72.97 JP4.4 15.69,72.54 15.69,70.81 13.96,69.09 13.96,62.61 21.3,55.27 21.3,41.45 26.05,36.7 26.05,19.43 | 76.14,72.97 75.71,73.41 76.14,73.84 73.55,76.43 73.55,79.02 J1.3 | 76.14,72.97 73.98,72.97 JP1.4 | 76.14,72.97 JP1.5 | JP3.4 39.87,72.97 42.03,72.97 JP3.5 42.46,73.41 42.46,73.84 44.62,76 56.71,76 | 56.71,76 56.71,79.02 J2.3 | 56.71,76 59.3,73.41 JP2.5 58.87,72.97 56.71,72.97 JP2.4 | 48.07,8.2 48.07,14.68 47.21,15.55 47.21,16.41 U3.20 47.21,16.84 47.21,19 47.64,19.43 48.5,19.43 50.66,21.59 51.09,21.59 52.39,22.89 52.39,24.18 U3.7 52.39,24.61 52.39,26.34 53.68,27.64 58.43,27.64 61.02,30.23 v66.21,30.23 | 48.07,8.2 48.07,6.48 45.05,3.45 43.32,3.45 41.59,5.18 41.59,5.61 J6.2 41.16,5.61 27.34,19.43 26.05,19.43 | 26.05,19.43 21.3,19.43 JP6.2 | 48.07,8.2 70.52,8.2 72.25,6.48 72.25,6.04 JP_LCD.3
  Bottom 0.559: 16.98,75.56 16.98,74.7 18.28,73.41 JP4.5 | 16.98,75.56 16.98,76 14.82,78.16 14.82,79.02 J4.3 | 39.87,76.43 39.87,79.02 J3.3 | 39.87,76.43 42.46,73.84 42.46,73.41 JP3.5 | JP1.4 73.55,72.97 73.55,73.84 71.82,75.56 62.32,75.56 61.89,75.13 60.59,75.13 59.3,73.84 59.73,73.41 59.73,72.97 59.3,72.97 JP2.5 | 16.98,75.56 39,75.56 39.87,76.43 | 71.82,25.04 73.55,23.32 73.55,22.45 R5.1 | 71.82,25.04 66.64,30.23 v66.21,30.23 65.34,30.23 R17.2 | 71.82,25.04 78.73,31.95 79.59,31.95 JP_SERIAL.4 | R11.1 72.68,12.95 72.68,10.36 R12.1 72.68,9.93 72.68,6.04 JP_LCD.3 | R15.2 52.39,28.07 52.39,24.61 U3.7
+5V3A
  Top 0.813: 11.85,32.41 6.26,32.41 L2.1 | 11.85,32.41 20.79,32.41 U2.4 | X1.1 9.62,9.5 9.62,15.09 11.85,17.32 C2.+ | JP6.1 20.79,17.32 12.41,17.32 C2.+ | 11.85,32.41 11.85,17.88 C2.+
BTN0  (via drill 0.38)
  Top 0.457: R2.1 77.89,68.2 77.89,71.63 78.65,72.39 JP1.6 | 58,32.77 64.94,32.77 73.32,41.15 73.32,54.48 74.08,55.24 75.99,55.24 79.03,58.29 79.03,62.86 78.65,63.25 77.13,63.25 75.99,62.1 75.6,62.1 v75.27,62.18
  Top 0.559: v58,28.93 58,32.77 58,34.11 58.43,34.54 58.43,38.86 54.55,42.75 33.82,42.75 33.39,43.18 32.09,43.18 30.37,44.91 | v75.27,62.18 36.41,62.18
  Bottom 0.457: R1.1 80.94,74.3 78.73,74.3 78.65,74.3 | JP1.6 78.65,72.39 78.65,65.53 77.89,64.77 77.87,64.77
  Bottom 0.559: v58,28.93 58,27.64 59.73,25.91 59.73,24.61 U3.4 | 77.87,64.77 v75.27,62.18 | J1.4 72.25,82.04 72.25,83.34 72.68,83.77 76.14,83.77 78.73,81.18 78.73,74.3 78.73,72.97 JP1.6
BTN1  (via drill 0.38)
  Top 0.559: 62.32,72.11 63.18,71.25 63.18,66.5 62.75,66.06 61.46,66.06 R24.1 | 62.32,72.11 61.89,72.11 61.46,72.54 JP2.6 62.32,72.11 | v29.94,43.61 29.94,44.04 29.5,44.47 29.5,47.93 28.21,49.22 28.21,55.7 v33.39,60.88 | v61.46,76.43 63.18,74.7 63.18,74.27 62.32,73.41 62.32,72.11
  Bottom 0.559: 61.02,65.2 61.02,71.25 61.89,72.11 61.89,72.54 JP2.6 | 61.02,65.2 61.02,63.04 R22.1 | v29.94,43.61 31.23,42.32 31.23,23.75 33.39,21.59 54.55,21.59 54.98,22.02 54.98,24.18 U3.6 | v33.39,60.88 54.12,60.88 58.43,65.2 61.02,65.2 | v61.46,76.43 61.46,81.18 58.87,83.77 55.84,83.77 55.41,83.34 55.41,82.04 J2.4
BTN2  (via drill 0.38)
  Top 0.305: v27.29,63.09 27.29,49.07 28.51,47.85 28.51,39.01 36.74,30.79 36.74,24.69 U3.13
  Top 0.457: R20.1 43.6,70.1 43.6,71.25 44.36,72.01 JP3.6
  Top 0.559: R21.1 43.32,66.06 44.18,66.06 46.34,68.22 46.34,70.81 45.05,72.11 44.62,72.11 44.62,72.54 JP3.6 | v42.46,76 44.62,78.16 44.62,81.18 42.03,83.77 39.87,83.77 38.57,82.47 38.57,82.04 J3.4
  Bottom 0.305: 44.36,72.85 JP3.6 | 34,69.8 v27.29,63.09
  Bottom 0.457: JP3.6 44.36,72.39 43.6,72.39 41.7,70.48 34.84,70.48 34.08,69.72 34,69.8
  Bottom 0.559: v42.46,76 44.62,73.84 44.62,72.97 JP3.6
BTN3
  Top 0.559: 20.87,66.06 19.14,66.06 R26.1 | 20.87,66.06 22.16,67.36 22.16,71.25 21.3,72.11 20.87,72.11 20.44,72.54 JP4.6 | 20.87,66.06 26.48,60.45 26.48,48.36 27.78,47.07 27.78,29.36 32.53,24.61 34.25,24.61 U3.14
  Bottom 0.559: 19.57,70.38 19.57,70.81 20.87,72.11 20.87,72.54 JP4.6 | 19.57,70.38 19.57,64.34 18.71,63.47 19.14,63.04 19.14,62.18 R25.1 | 2.3,83.34 4.03,85.06 6.19,85.06 6.62,84.63 12.23,84.63 13.53,83.34 13.53,82.04 J4.4 | 2.3,75.13 7.05,70.38 19.57,70.38
  Bottom 0.61: 2.3,75.13 2.29,75.13 1.23,76.2 1.23,82.26 2.3,83.34
DTR
  Top 0.559: C5.2 80.02,21.16 80.02,21.59 80.89,22.45 80.89,22.89 79.59,24.18 JP_SERIAL.1
GND  (via drill 0.6)
  Top 0.305: LED1.C 39.79,66.14 39.79,66.08
  Top 0.813: 36.44,53.9 36.44,53.64 K1.6 36.44,53.09
  Bottom 0.305: 13.27,44.2 13.26,44.22 | 51.68,16.76 U3.22
  other vias: 17.03,62 25.03,68 77.03,76 45.03,83 72.03,28 38.03,69.2 63.33,83.4 56.03,70.1 11.83,62.9 2.93,79.4
  pour Bottom (isolate 0.406): 0.03,4 arc90 6.03,0 85.03,0 arc90 88.03,3 88.03,88 arc90 83.03,92 7.03,92 arc90 0.03,87
  pour Top (isolate 0.406): 0.03,5 arc90 5.03,0 85.03,0 arc90 88.03,3 88.03,88 arc90 83.03,92 4.03,92 arc90 0.03,87
MISO
  Bottom 0.559: U3.18 42.03,16.41 42.03,14.68 42.46,14.25 43.75,14.25 44.62,13.39 45.05,13.39 46.78,11.66 46.78,7.34 45.05,5.61 44.62,6.04 44.18,6.04 J6.1
MOSI
  Top 0.559: U3.17 39.43,16.41 39.43,15.11 38.57,14.25 38.57,10.8 40.73,8.64 41.59,8.64 J6.4
N$1
  Top 0.559: U3.10 44.62,24.61 44.62,30.23 49.37,34.98 C11.2 48.93,35.41 50.66,37.13 50.66,38.86 49.37,40.16 Y3.1
N$2
  Top 0.559: 52.82,32.82 52.82,33.68 53.68,34.54 53.25,34.98 53.25,35.41 53.68,35.41 C10.2 | 52.82,32.82 52.82,31.09 47.21,25.48 47.21,24.61 U3.9 | 52.82,32.82 51.53,34.11 51.53,37.57 53.68,39.72 53.68,40.16 Y3.2
N$3  (via drill 0.38)
  Top 0.305: 30.55,52.5 v30.37,52.68
  Top 0.406: K1.8 39,53.77
  Top 0.457: K1.8 38.65,54.1 37.5,55.24 31.03,55.24 29.88,54.1 29.88,53.34 30.27,52.96 v30.37,52.68
  Top 0.559: v60.16,43.18 55.41,43.18 54.98,43.61 39.87,43.61 v39.43,44.04
  Bottom 0.559: v60.16,43.18 61.02,42.32 R10.1 | v39.43,44.04 38.57,43.18 32.09,43.18 29.07,46.2 29.07,51.38 v30.37,52.68
N$4
  Top 0.813: U2.2 20.79,35.76 19.67,35.76 14.09,41.35 D1.C 13.53,41.35 10.17,38 6.26,38 L2.2
N$5  (via drill 0.38)
  Top 0.457: K1.10 41.7,54.1 42.46,54.1 43.6,55.24 64.94,55.24 65.7,54.48 65.7,43.43 66.84,42.29 66.84,35.81 64.56,33.53 63.79,33.53 63.03,34.29 63.03,41.88 63.03,41.91
  Top 0.559: v57.57,41.88 63.03,41.88 v64.91,41.88 | v29.94,41.88 v32.96,41.88 | v24.75,47.07 24.75,49.66 v24.32,50.09
  Bottom 0.559: v64.91,41.88 65.77,41.88 R13.1 | v57.57,41.88 55.41,41.88 54.55,42.75 44.18,42.75 43.32,41.88 v32.96,41.88 | v24.75,47.07 v29.94,41.88 | 41.59,53.54 K1.10
N$6
  Top 0.559: R18.2 68.37,68.22 70.96,68.22 LED7.A
N$7
  Top 0.559: R19.2 33.39,68.22 35.98,68.22 LED8.A
N$8
  Top 0.559: LED1.A 40.3,68.22 42.03,68.22 42.46,67.79 42.89,67.79 R21.2
N$9
  Top 0.559: LED2.A 58.43,68.22 60.16,68.22 61.02,67.36 61.46,67.79 R24.2
N$10
  Top 0.559: R26.2 18.71,67.79 16.12,67.79 LED6.A
N$11
  Top 0.559: R27.2 51.09,68.22 52.39,68.22 52.82,67.79 53.68,67.79 LED9.A
N$12
  Top 0.559: R28.2 9.21,68.22 11.8,68.22 LED10.A
N$13
  Top 0.559: R29.2 80.02,59.16 80.02,61.75 LED11.A
N$15
  Top 0.813: F2.1 14.64,56.44 10.73,56.44 J5.PWR
N$23
  Top 0.457: LED3.A 75.22,65.91 77.51,65.91 R2.2
N$24
  Top 0.559: R3.2 75.71,26.34 75.71,26.77 76.14,27.2 76.14,28.07 76.57,28.5 76.14,28.93 LED4.A
N$25
  Top 0.559: R4.2 76.14,33.68 76.14,34.98 75.71,35.41 75.71,35.84 LED5.A
NPN0-OUT
  Top 0.559: JP1.2 68.8,72.97 70.96,72.97 JP1.3 71.39,73.41 71.39,73.84 68.8,76.43 68.8,79.02 69.23,79.45 | 69.23,79.45 68.8,79.88 68.8,80.31 70.09,81.61 J1.6 | 69.23,79.45 69.66,79.02 70.96,79.02 J1.5
  Bottom 0.559: Q5.3 65.77,83.34 68.37,83.34 69.66,82.04 J1.6
NPN1-OUT
  Top 0.559: JP2.2 51.96,72.97 53.25,72.97 53.68,72.54 54.12,72.97 JP2.3
  Bottom 0.559: 50.66,82.91 51.53,82.91 52.39,82.04 52.39,81.61 52.82,81.61 J2.6 | 50.66,82.91 48.07,82.91 Q1.3 | 52.39,79.02 54.12,79.02 J2.5 | 52.39,79.02 50.66,80.75 50.66,82.91 | 52.39,79.02 51.96,78.59 51.96,74.7 51.53,74.27 51.53,72.97 JP2.2
NPN2-OUT
  Top 0.559: JP5.1 85.21,66.06 85.21,75.56 76.14,84.63 38.14,84.63 35.55,82.04 J3.6
  Bottom 0.559: 33.39,82.91 33.82,82.91 35.55,81.18 35.98,81.18 35.98,81.61 J3.6 | 33.39,82.91 30.37,82.91 Q4.3 | 33.39,82.91 33.39,79.45 35.55,77.29 36.84,78.59 36.84,79.02 J3.5
NPN2-OUT1
  Top 0.559: JP3.2 34.69,72.97 36.84,72.97 JP3.3
NPN3-OUT
  Top 0.559: 12.23,72.97 13.1,72.97 JP4.3 12.23,72.97 | 12.23,72.97 10.94,72.97 JP4.2 | 12.23,72.97 14.39,75.13 | 14.39,75.13 14.82,75.56 21.3,75.56 23.03,73.84 23.03,72.97 32.53,63.47 76.14,63.47 77,64.34 80.89,64.34 81.75,63.47 84.77,63.47 JP5.2 | 14.39,75.13 13.96,75.56 12.66,75.56 10.5,77.72 11.8,79.02 J4.5
  Bottom 0.559: 8.35,82.91 8.78,82.91 10.5,81.18 10.94,81.18 10.94,81.61 J4.6 | 8.35,82.91 5.32,82.91 Q6.3 | 8.35,82.91 8.35,80.75 10.07,79.02 11.8,79.02 J4.5
NPN4-OUT
  Bottom 0.457: Q7.3 86.65,81.15 86.65,79.25 87.42,78.49 87.42,76.2 85.89,74.68 85.64,74.68
  Bottom 0.559: 85.64,74.7 85.64,74.68 85.64,68.22 87.36,66.5 87.36,62.18 86.07,60.88 85.21,60.88 JP5.3
PI+5V
  Top 0.559: K1.2 31.66,53.54 33.82,53.54 K1.4
  Bottom 0.559: JP6.3 21.3,22.45 23.46,24.61 23.46,47.5 29.07,53.11 29.07,53.54 29.94,54.41 30.37,54.41 31.23,53.54 K1.2
PWM0  (via drill 0.38)
  Top 0.457: v58.84,57.53 57.7,57.53 56.17,56.01 v30.27,56.01
  Top 0.559: v64.05,73.41 64.05,68.22 66.21,66.06 67.93,66.06 R18.1 | v67.07,74.27 67.07,77.72 v67.5,78.16 | v24.75,43.61 23.03,45.34 23.03,50.52 v24.32,51.82
  Bottom 0.457: 29.39,56.88 v30.27,56.01 | v58.84,57.53 58.69,57.68
  Bottom 0.559: 67.07,78.59 66.64,78.16 R23.1 | 67.07,78.59 67.93,79.45 67.93,79.88 66.64,81.18 Q5.1 | v67.07,74.27 66.64,74.7 65.34,74.7 v64.05,73.41 64.05,72.54 63.62,72.11 63.62,62.61 58.69,57.68 58.43,57.43 | 67.07,78.59 v67.5,78.16 | v24.75,43.61 26.05,42.32 26.05,27.64 32.96,20.73 55.84,20.73 57.14,22.02 57.14,24.18 U3.5 | 29.94,57.43 29.39,56.88 v24.32,51.82
PWM1  (via drill 0.38)
  Top 0.559: 47.64,67.79 47.21,68.22 47.21,71.25 46.78,71.68 46.78,72.11 46.34,72.54 46.34,73.41 46.78,73.84 46.78,74.27 47.64,75.13 48.5,75.13 v48.93,74.7 | 47.64,67.79 49.37,66.06 50.66,66.06 R27.1 | v29.94,40.16 29.94,38.86 42.03,26.77 42.03,24.61 U3.11 | v25.62,44.47 26.05,44.04 26.05,43.18 25.19,42.32 24.32,42.32 22.16,44.47 22.16,55.7 v25.19,58.72 | v39,64.77 39.43,64.34 44.18,64.34 47.64,67.79
  Bottom 0.559: 50.66,79.02 50.66,79.45 49.37,80.75 Q1.1 | 50.66,79.02 49.8,78.16 48.93,78.16 R6.1 | v48.93,74.7 48.5,75.13 49.37,76 50.23,76 51.09,76.86 51.09,78.59 50.66,79.02 | v25.62,44.47 v29.94,40.16 | v25.19,58.72 32.53,66.06 37.71,66.06 v39,64.77
PWM2  (via drill 0.38)
  Top 0.559: 32.96,66.06 31.23,66.06 28.21,69.09 v28.21,76.86 | v25.19,57 25.62,56.57 25.62,47.93 26.91,46.63 26.91,28.07 33.39,21.59 39,21.59 39.43,22.02 39.43,24.18 U3.12 | 32.96,66.06 v32.96,64.77 | 32.96,66.06 R19.1
  Bottom 0.559: Q4.1 31.23,80.75 31.23,78.16 R7.1 30.8,77.72 30.8,76.86 30.37,76.43 28.64,76.43 v28.21,76.86 | v32.96,64.77 v25.19,57
PWM3  (via drill 0.38)
  Top 0.559: v6.19,79.45 5.32,78.59 5.32,72.11 7.48,69.95 7.48,69.52 7.91,69.09 7.91,66.93 8.35,66.5 8.78,66.5 R28.1
  Top 0.61: 17.44,43.59 19.23,45.37 19.23,55.8 17.47,57.56 17.44,57.56 14.39,60.6 9.73,60.6 9.06,61.27 9.06,65.94
  Top 0.813: v24.7,26.82 24.7,36.32 17.44,43.59 | 9.06,65.94 R28.1
  Bottom 0.559: Q6.1 6.19,80.75 v6.19,79.45 6.19,78.16 R8.1
  Bottom 0.813: v24.7,26.82 34.2,17.32 U3.15
PWM4  (via drill 0.38)
  Top 0.559: v77.87,60.45 77.87,59.16 R29.1 77.87,58.72 v58,58.72
  Bottom 0.457: Q7.1 84.37,80.39 86.27,78.49 R9.1 85.89,78.11 85.89,76.2 80.94,71.25 80.94,65.53 77.89,62.48 77.87,62.48
  Bottom 0.559: 77.87,62.61 77.87,62.48 v77.87,60.45 | v58,58.72 29.5,58.72 18.28,47.5 18.28,15.98 20.44,13.82 35.55,13.82 36.84,15.11 36.84,16.41 U3.16
RESET
  Bottom 0.559: U3.1 67.07,24.61 67.5,25.04 67.93,25.04 72.25,20.73 73.55,20.73 R5.2 73.98,20.73 74.84,19.86 75.27,19.86 | 75.27,19.86 76.14,20.73 77,20.73 C5.1 | 75.27,19.86 77.43,17.7 | 77.43,17.7 78.73,16.41 79.59,16.41 S1.1 | 77.43,17.7 78.3,18.57 83.05,18.57 85.21,16.41 86.07,16.41 S1.2
RX
  Top 0.559: 68.8,27.2 68.37,27.64 66.64,27.64 64.91,25.91 64.91,24.61 U3.2 | 68.8,27.2 69.66,26.34 73.98,26.34 R3.1 | 68.8,27.2 72.25,30.66 77,30.66 77.87,29.79 79.59,29.79 JP_SERIAL.3
  Bottom 0.559: Q3.3 62.32,34.11 62.32,31.09 64.48,28.93 64.91,28.93 65.34,28.5 R17.1 64.91,28.07 64.91,24.61 U3.2
RX_3V3
  Bottom 0.559: Q3.2 63.18,36.7 63.18,37.57 62.75,38 62.75,38.86 R16.1 63.18,39.29 64.48,40.59 63.18,41.88 R10.2
SCK
  Top 0.559: U3.19 44.62,16.41 44.62,14.68 44.18,14.25 46.34,12.09 46.34,9.93 44.62,8.2 J6.3
SCL
  Bottom 0.559: 74.41,14.68 74.41,13.39 R11.2 | 74.41,14.68 72.25,16.84 U3.28 | 74.41,14.68 74.84,15.11 75.27,15.11 77.43,12.95 77.43,6.04 JP_LCD.1
SCL_3V3
  Bottom 0.559: K1.5 36.84,50.95 36.84,50.09 39,47.93 37.28,46.2 37.28,45.77 37.71,45.77 JP_RTC.3
SDA
  Top 0.559: U3.27 64.91,16.41 64.91,14.68 65.34,14.25 66.64,14.25 72.68,8.2 73.12,8.2 74.84,6.48 74.41,6.04 74.84,5.61 JP_LCD.2
  Bottom 0.559: R12.2 74.41,9.93 74.41,7.77 74.84,7.34 74.84,6.48 74.41,6.04 74.84,5.61 JP_LCD.2
SDA_3V3
  Bottom 0.559: K1.3 34.25,50.95 34.25,50.09 35.55,48.79 35.55,46.2 JP_RTC.4
TX  (via drill 0.38)
  Top 0.559: R4.1 73.98,33.68 73.12,33.68 v72.68,34.11 71.82,34.11 65.34,27.64 64.05,27.64 62.32,25.91 62.32,24.61 U3.3
  Bottom 0.559: Q2.3 67.5,34.11 v72.68,34.11 78.3,39.72 80.89,39.72 82.61,38 82.61,28.07 81.75,27.2 80.02,27.2 JP_SERIAL.2 | R15.1 52.39,30.23 53.25,30.23 53.68,30.66 58,30.66 62.32,26.34 62.32,24.61 U3.3
TX_3V3
  Bottom 0.559: 69.23,37.57 68.37,36.7 Q2.2 | 69.23,37.57 69.23,38 68.37,38.86 67.93,38.86 67.5,39.29 67.93,39.72 R14.1 | 69.23,37.57 70.09,38.43 70.09,41.02 69.23,41.88 67.93,41.88 R13.2
VCC
  Top 0.559: JP4.1 8.35,73.41 8.35,73.84 9.21,74.7 9.21,80.31 8.35,81.18 8.35,82.47 9.64,83.77 14.39,83.77 16.12,82.04 J4.2
  Top 0.813: U2.1 20.23,38 20.23,39.12 15.2,44.14 15.2,45.82 F2.2 14.64,45.82 4.59,45.82 C3.1 | J1.1 76.11,79.35 74.99,80.47 74.99,81.58 J1.2 74.44,82.14 73.32,83.26 69.41,83.26 62.98,76.83 | J2.2 58.23,81.58 58.23,79.91 58.79,79.35 J2.1 59.35,78.79 61.02,78.79 62.98,76.83 | 62.98,76.83 65.5,74.32 65.5,73.2 JP1.1 | J3.2 41.47,81.58 41.47,79.91 42.03,79.35 J3.1 42.03,78.79 38.67,75.44 31.97,75.44 31.69,75.16 | J4.2 16.32,81.58 16.88,81.03 16.88,79.35 J4.1 17.44,78.79 28.06,78.79 31.69,75.16 | 31.69,75.16 31.97,74.88 31.97,73.2 JP3.1
  Bottom 0.559: JP5.4 84.77,58.29 83.48,57 78.73,57 64.48,71.25 66.21,72.97 JP1.1
  Bottom 0.813: JP2.1 48.73,73.2 42.58,79.35 J3.1 | J1.1 76.11,78.79 73.88,76.55 63.82,76.55 62.7,77.67 62.7,81.58 59.35,84.94 44.26,84.94 41.47,82.14 J3.2 | F2.2 15.2,46.38 15.2,53.09 31.97,69.85 31.97,72.64 JP3.1

### Text on the board
Bottom: (c) 2015 | P. Bronneberg
tPlace: btn | btn | btn | btn | vcc | vcc | vcc | vcc | pwm | pwm | pwm | pwm | AUX4 | AUX3 | AUX2 | AUX1 | vcc | pwm | btn | vcc | pwm | 5v | pwm | 5v | vcc | 5v | btn | vcc | pwm | 5v | btn | B | 12V-5A | R | G | vcc | 3A FUSE | 100uF | PiBooth | v2.0 | + | RTC | VCC | GND | L | + | NC | SERIAL | GND | 5V | 5V | RX | GND | TX | Pi | DTR | + | 1000uF | ATMEGA328P | Power | 5V/3A | GND | Reset | MOSI | SCK | GND | 5V | SDA | SCL | 5V | GND | 5v | MISO | ICSP | LCD | C:/Users/nly96192/Desktop/ItsMyPartyLogo2-LogoOnly-BW.bmp | C:/Users/nly96192/Desktop/ItsMyPartyLogo2-LogoOnly-BW.bmp | C:/Users/nly96192/Desktop/ItsMyPartyLogo2-TextOnly-bw.bmp | C:/Users/nly96192/Desktop/ItsMyPartyLogo2-TextOnly-bw.bmp | +